# Altium schematic sheet 0210_TBT_HPD_Level_Shif.SchDoc
size A3
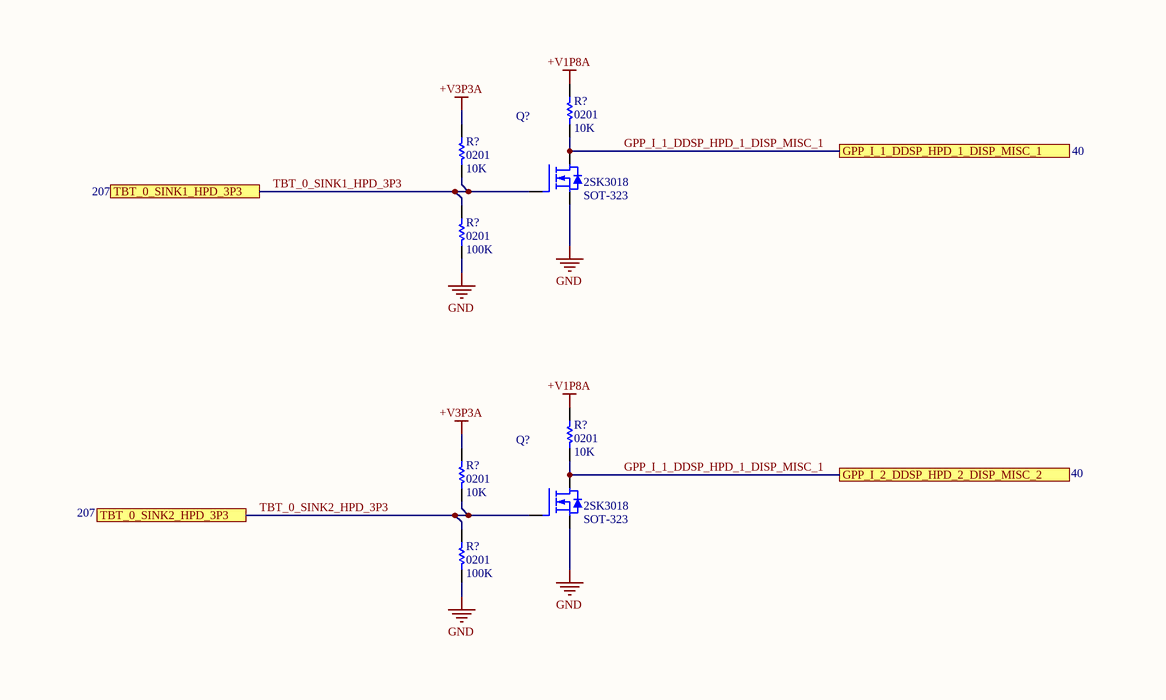
[diagram p0: 0210_TBT_HPD_Level_Shif.SchDoc, left]

## Parts
(Parts that share a designator on the sheet are numbered #1, #2 ... from top to bottom, then left to right.)
Q?#1  Manufacturer Part Number: 2SK3018  Case/Package: SOT-323  [SOT323]  (hidden comment: MOSFET N_2SK3018)
Q?#2  Manufacturer Part Number: 2SK3018  Case/Package: SOT-323  [SOT323]  (hidden comment: MOSFET N_2SK3018)
R?#1  value 10K  Case/Package: 0201  [RESC0201]  (hidden comment: Res)
R?#2  value 10K  Case/Package: 0201  [RESC0201]  (hidden comment: Res)
R?#3  value 100K  Case/Package: 0201  [RESC0201]  (hidden comment: Res)
R?#4  value 10K  Case/Package: 0201  [RESC0201]  (hidden comment: Res)
R?#5  value 10K  Case/Package: 0201  [RESC0201]  (hidden comment: Res)
R?#6  value 100K  Case/Package: 0201  [RESC0201]  (hidden comment: Res)

## Ports
GPP_I_1_DDSP_HPD_1_DISP_MISC_1, GPP_I_2_DDSP_HPD_2_DISP_MISC_2, TBT_0_SINK1_HPD_3P3, TBT_0_SINK2_HPD_3P3

## Nets
+V1P8A: R?#1.2 R?#4.2
+V3P3A: R?#2.2 R?#5.2
GND: Q?#1.2(SOURCE) Q?#2.2(SOURCE) R?#3.1 R?#6.1
GPP_I_1_DDSP_HPD_1_DISP_MISC_1: Q?#1.3(DRAIN) Q?#2.3(DRAIN) R?#1.1 R?#4.1 ; port GPP_I_1_DDSP_HPD_1_DISP_MISC_1, port GPP_I_2_DDSP_HPD_2_DISP_MISC_2
TBT_0_SINK1_HPD_3P3: Q?#1.1(GATE) R?#2.1 R?#3.2 ; port TBT_0_SINK1_HPD_3P3
TBT_0_SINK2_HPD_3P3: Q?#2.1(GATE) R?#5.1 R?#6.2 ; port TBT_0_SINK2_HPD_3P3

## Library data of the parts
Q?#1 Q?#2 = MOSFET N_2SK3018: NMOS,2SK3018,SOT_323,Id=0.1A,Vds=30V
R?#1 R?#2 R?#4 R?#5 = Res: Thick Film Resistor - 10Kohm, 1%, 0201
R?#3 R?#6 = Res: Thick Film Resistor - 100Kohm, 1%, 0201